# Altium schematic sheet OpenPilot Atom.SchDoc: OpenPilot Atom
size A3; Author: David Ankers; DrawnBy: David Ankers; Engineer: David Ankers; Organization: The OpenPilot Project; DocumentNumber: 1; Revision: A; SheetNumber: 1; SheetTotal: 2; License: Creative Commons BY-NC-SA Non commercial use only; ProjectName: OpenPilot
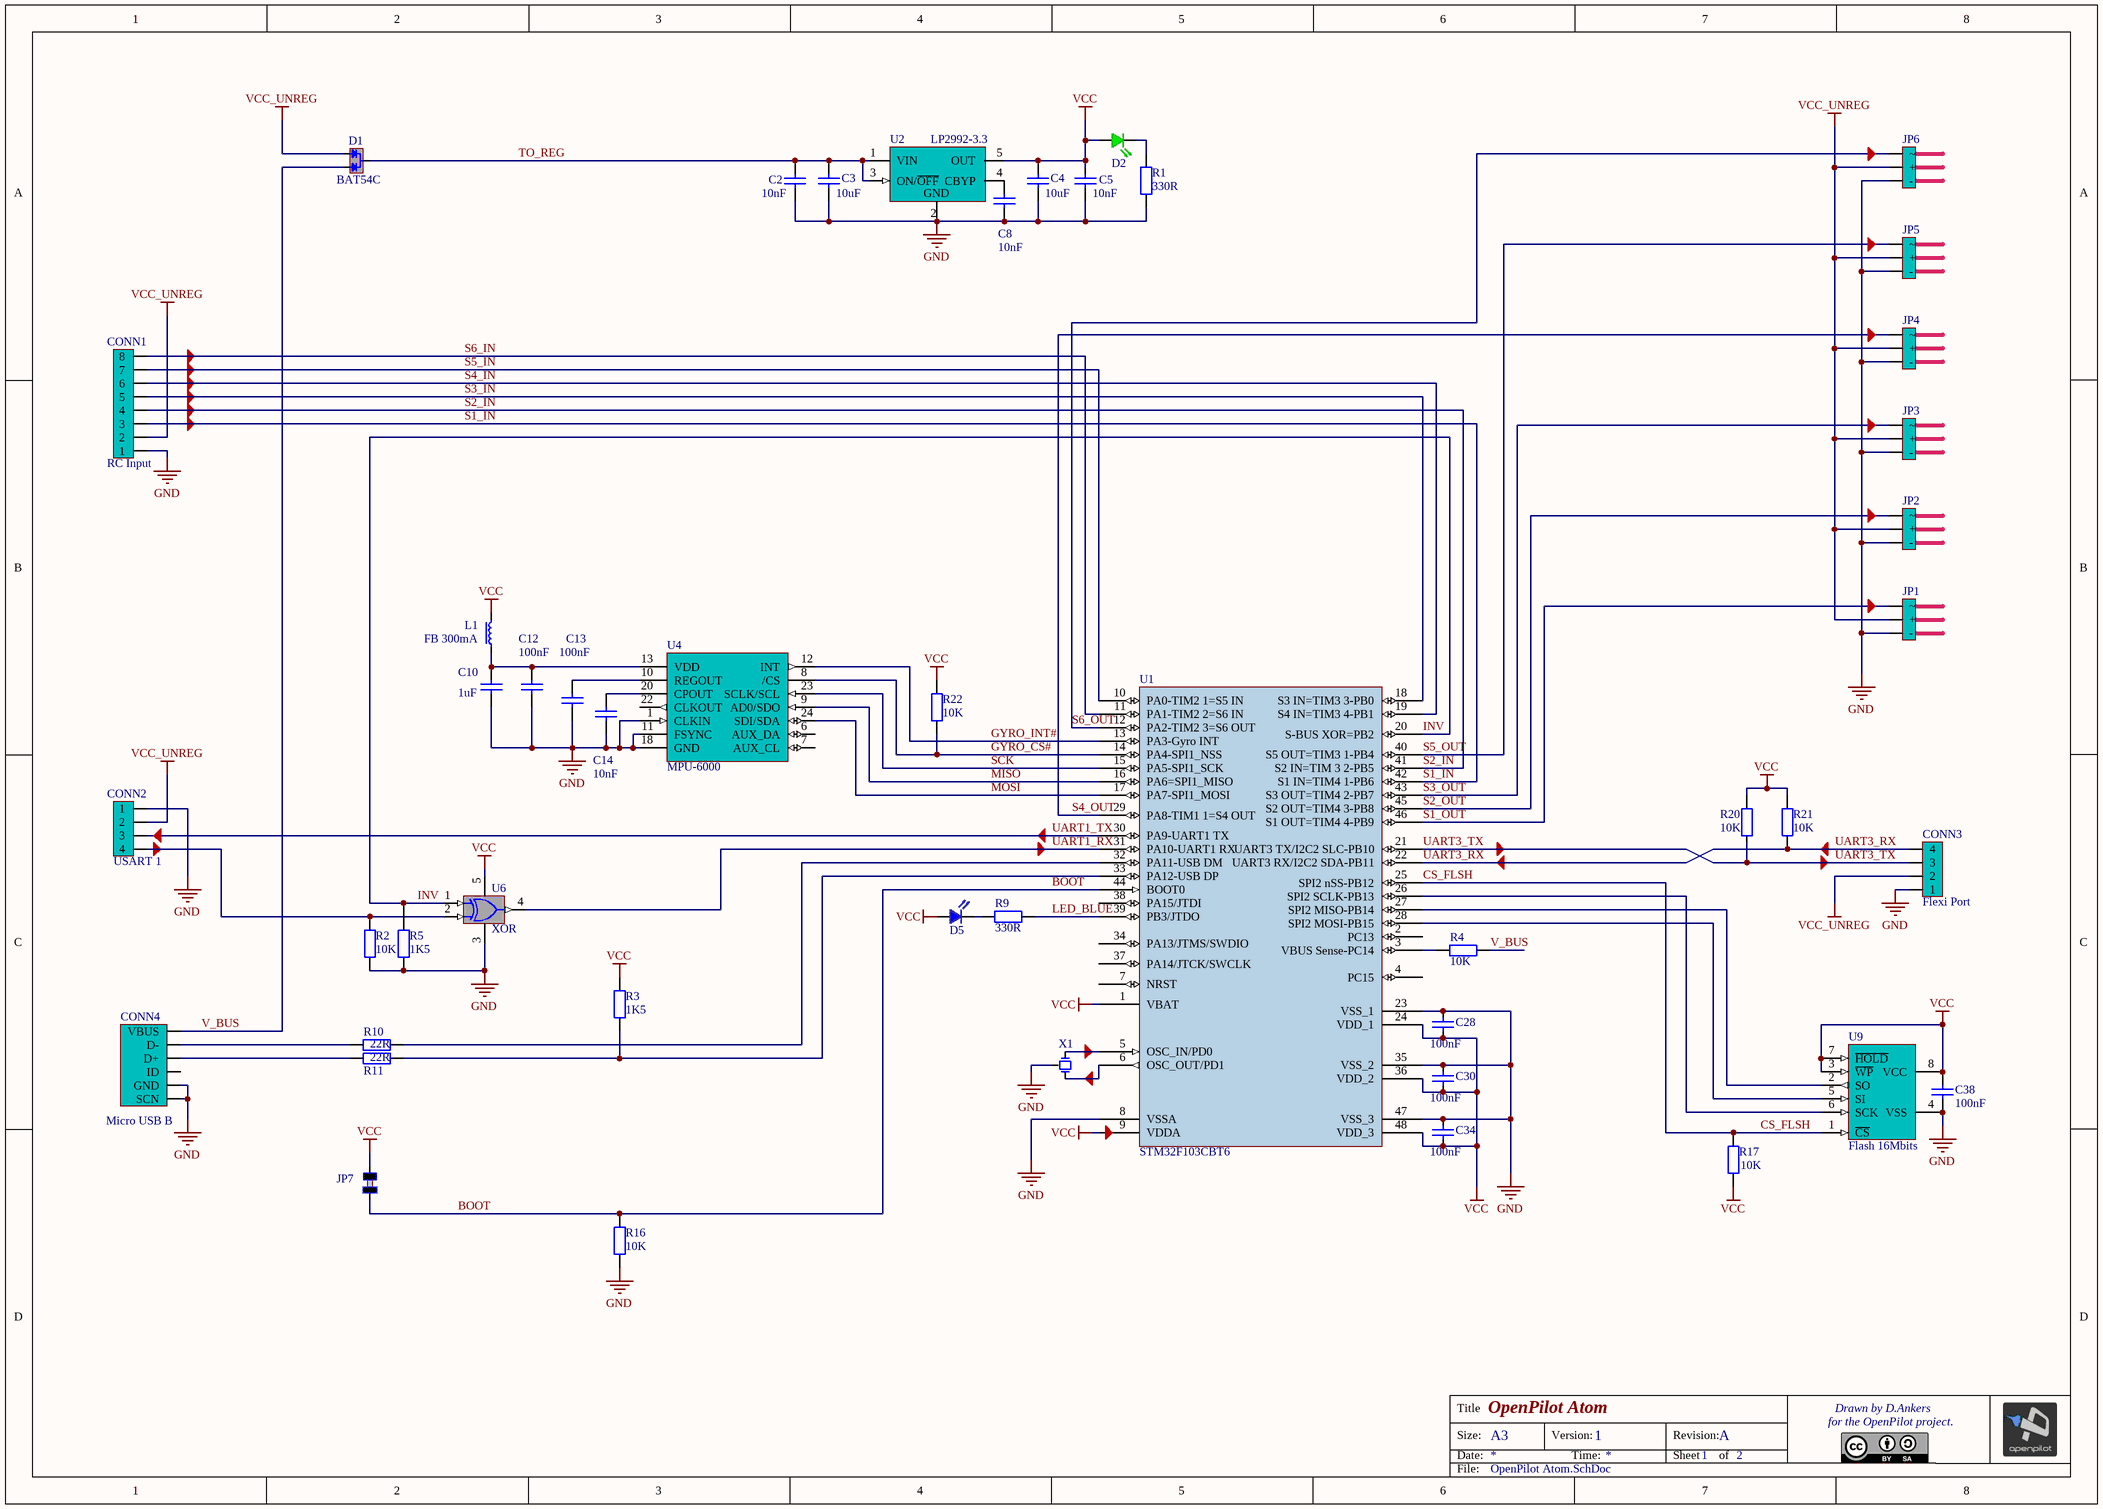
[diagram p0: OpenPilot Atom.SchDoc]

## Parts
C2  value 10nF  [CAP402N]  (hidden comment: 10n)
C3  value 10uF  [CAP805L]  (hidden comment: Cap805)
C4  value 10uF  [CAP805L]  (hidden comment: Cap805)
C5  value 10nF  [CAP402N]  (hidden comment: 10n)
C8  value 10nF  [CAP402N]  (hidden comment: 10n)
C10  1uF  [CAP402N]
C12  value 100nF  [CAP402N]  (hidden comment: Cap402)
C13  value 100nF  [CAP402N]  (hidden comment: Cap402)
C14  value 10nF  [CAP402N]  (hidden comment: 10n)
C28  value 100nF  [CAP402N]  (hidden comment: Cap402)
C30  value 100nF  [CAP402N]  (hidden comment: Cap402)
C34  value 100nF  [CAP402N]  (hidden comment: Cap402)
C38  value 100nF  [CAP402N]  (hidden comment: Cap402)
CONN1  RC Input  [JST SH 8 Pin Side Entry]
CONN2  USART 1  [JST SH 4 Pin Side Entry]
CONN3  Flexi Port  [JST SH 4 Pin Side Entry]
CONN4  Micro USB B  [Micro_USB]
D1  BAT54C  [SOT23-3N]
D2  Green  [LED603N]  (value not drawn)
D5  Blue  [LED603N]  (value not drawn)
JP1  Servo out 1  [SIP3 - 0.1]  (value not drawn)
JP2  Servo out 2  [SIP3 - 0.1]  (value not drawn)
JP3  Servo out 3  [SIP3 - 0.1]  (value not drawn)
JP4  Servo out 4  [SIP3 - 0.1]  (value not drawn)
JP5  Servo out 5  [SIP3 - 0.1]  (value not drawn)
JP6  Servo out 6  [SIP3 - 0.1]  (value not drawn)
JP7  2 PAD Touch JMP  [TOUCH JMP 2PAD]  (value not drawn)
L1  FB 300mA  [IND603N]
R1  value 330R  [RES402N]  (hidden comment: Res402)
R2  value 10K  [RES402N]  (hidden comment: Res402)
R3  value 1K5  [RES402N]  (hidden comment: Res402)
R4  value 10K  [RES402N]  (hidden comment: Res402)
R5  value 1K5  [RES402N]  (hidden comment: Res402)
R9  value 330R  [RES402N]  (hidden comment: Res402)
R10  value 22R  [RES402N]  (hidden comment: Res402)
R11  value 22R  [RES402N]  (hidden comment: Res402)
R16  value 10K  [RES402N]  (hidden comment: Res402)
R17  value 10K  [RES402N]  (hidden comment: Res402)
R20  value 10K  [RES402N]  (hidden comment: Res402)
R21  value 10K  [RES402N]  (hidden comment: Res402)
R22  value 10K  [RES402N]  (hidden comment: Res402)
U1  STM32F103CBT6  [STM32 48 Lead]
U2  LP2992-3.3  [SOT23-5L]
U4  MPU-6000  [IMU-3000]
U6  XOR  [DCK-5]
U9  Flash 16Mbits  [SOIC8_N]
X1  8Mhz Ceralock  [CERALOCK 8Mhz]  (value not drawn)

## Nets
GND: C2.2 C3.2 C4.2 C5.2 C8.2 C10.2 C12.2 C13.2 C14.1 C28.1 C30.1 C34.1 C38.2 CONN1.1 CONN2.1 CONN3.1 CONN4.0(SCN) CONN4.5(GND) JP1.3(-) JP2.3(-) JP3.3(-) JP4.3(-) JP5.3(-) JP6.3(-) R1.1 R2.1 R5.1 R16.1 U1.8(VSSA) U1.23(VSS_1) U1.35(VSS_2) U1.47(VSS_3) U2.2(GND) U4.1(CLKIN) U4.11(FSYNC) U4.18(GND) U6.3(GND) U9.4(VSS) X1.3
VCC: C4.1 C5.1 C28.2 C30.2 C34.2 C38.1 D2.2(A) D5.2(A) JP7.2 L1.2 R3.2 R17.1 R20.2 R21.2 R22.2 U1.1(VBAT) U1.9(VDDA) U1.24(VDD_1) U1.36(VDD_2) U1.48(VDD_3) U2.5(OUT) U6.5(VCC) U9.3(~{WP}) U9.7(~{HOLD}) U9.8(VCC)
VCC_UNREG: CONN1.2 CONN2.2 CONN3.2 D1.1(A1) JP1.2(+) JP2.2(+) JP3.2(+) JP4.2(+) JP5.2(+) JP6.2(+)
BOOT: JP7.1 R16.2 U1.44(BOOT0)
CS_FLSH: R17.2 U1.25(SPI2_nSS-PB12) U9.1(~{CS})
GYRO_CS#: R22.1 U1.14(PA4-SPI1_NSS) U4.8(/CS)
GYRO_INT#: U1.13(PA3-Gyro_INT) U4.12(INT)
INV: R5.2 U1.20(S-BUS_XOR=PB2) U6.1(A)
LED_BLUE: R9.2 U1.39(PB3/JTDO)
MISO: U1.16(PA6=SPI1_MISO) U4.9(AD0/SDO)
MOSI: U1.17(PA7-SPI1_MOSI) U4.24(SDI/SDA)
S1_IN: CONN1.3 U1.42(S1_IN=TIM4_1-PB6)
S1_OUT: JP1.1 U1.46(S1_OUT=TIM4_4-PB9)
S2_IN: CONN1.4 U1.41(S2_IN=TIM_3_2-PB5)
S2_OUT: JP2.1 U1.45(S2_OUT=TIM4_3-PB8)
S3_IN: CONN1.5 U1.18(S3_IN=TIM3_3-PB0)
S3_OUT: JP3.1 U1.43(S3_OUT=TIM4_2-PB7)
S4_IN: CONN1.6 U1.19(S4_IN=TIM3_4-PB1)
S4_OUT: JP4.1 U1.29(PA8-TIM1_1=S4_OUT)
S5_IN: CONN1.7 U1.10(PA0-TIM2_1=S5_IN)
S5_OUT: JP5.1 U1.40(S5_OUT=TIM3_1-PB4)
S6_IN: CONN1.8 U1.11(PA1-TIM2_2=S6_IN)
S6_OUT: JP6.1 U1.12(PA2-TIM2_3=S6_OUT)
SCK: U1.15(PA5-SPI1_SCK) U4.23(SCLK/SCL)
TO_REG: C2.1 C3.1 D1.3(COM) U2.1(VIN) U2.3(ON/~{OFF})
UART1_RX: U1.31(PA10-UART1_RX) U6.4(Y)
UART1_TX: CONN2.3 U1.30(PA9-UART1_TX)
UART3_RX: CONN3.4 R21.1 U1.22(UART3_RX/I2C2_SDA-PB11)
UART3_TX: CONN3.3 R20.1 U1.21(UART3_TX/I2C2_SLC-PB10)
V_BUS: CONN4.1(VBUS) D1.2(A2) R4.1
NetC8_1: C8.1 U2.4(CBYP)
NetC10_1: C10.1 C12.1 L1.1 U4.13(VDD)
NetC13_1: C13.1 U4.10(REGOUT)
NetC14_2: C14.2 U4.20(CPOUT)
NetCONN2_4: CONN2.4 R2.2 U6.2(B)
NetCONN4_2: CONN4.2(D-) R10.2
NetCONN4_3: CONN4.3(D+) R11.2
NetD2_1: D2.1(K) R1.2
NetD5_1: D5.1(K) R9.1
NetR3_1: R3.1 R11.1 U1.33(PA12-USB_DP)
NetR4_2: R4.2 U1.3(VBUS_Sense-PC14)
NetR10_1: R10.1 U1.32(PA11-USB_DM)
NetU1_5: U1.5(OSC_IN/PD0) X1.1
NetU1_6: U1.6(OSC_OUT/PD1) X1.2
NetU1_26: U1.26(SPI2_SCLK-PB13) U9.6(SCK)
NetU1_27: U1.27(SPI2_MISO-PB14) U9.2(SO)
NetU1_28: U1.28(SPI2_MOSI-PB15) U9.5(SI)

Not connected (* = marked no-connect by the designer): CONN4 4(ID); U1 2(PC13) 4(PC15) 7(NRST) 34(PA13/JTMS/SWDIO) 37(PA14/JTCK/SWCLK) 38(PA15/JTDI); U4 2(NC) 3(NC) 4(NC) 5(NC) 6(AUX_DA) 7(AUX_CL) 14(NC) 15(NC) 16(NC) 17(NC) 19(RESV) 21(RESV) 22(CLKOUT)

## Notes on the sheet
- Title
- Size:
- Date:
- A3
- Version:
- Time:
- Revision:
- Sheet
- of
- for the OpenPilot project.
- Drawn by D.Ankers
- File:

## Library data of the parts
C2 C5 C8 C10 C12-C14 C28 C30 C34 C38 = Cap402: Capacitor SMD; Publisher: The OpenPilot Project; Published: 1-Nov-2010; LatestRevisionDate: 1-Nov-2010; LatestRevisionNote: Released OpenPilot Lib; PackageReference: 0402 (1005 Metric); ComponentLink2Description: Datasheet; Supplier 1: Digi-Key
  C2 C5 C8 C14: Supplier Part Number 1: 587-1223-1-ND
  C10: Value: 1uF; Supplier Part Number 1: 445-4978-1-ND
  C12 C13 C28 C30 C34 C38: Supplier Part Number 1: 445-4952-1-ND
C3 C4 = Cap805: Capacitor SMD; Published: 1-Nov-2010; LatestRevisionDate: 1-Nov-2010; LatestRevisionNote: Released OpenPilot Lib; PackageReference: 0805 (2012 Metric); Publisher: The OpenPilot Project; Supplier 1: Digi-Key; Supplier Part Number 1: 490-3886-1-ND
CONN1 = JST-SH 8-pin Side Entry Socket: Manufacturer: Generic Components; Class: Connector; Supplier 1: Digi-Key; Supplier Part Number 1: 455-1808-1-ND
CONN2 CONN3 = JST-SH 4-pin Side Entry Socket: Manufacturer: Generic Components; Class: Connector; Supplier 1: Digi-Key; Supplier Part Number 1: 455-1804-1-ND
CONN4 = USB Micro B SMT: USB Micro B SMT Socket; Class: Connector; ComponentLink2Description: Datasheet; LatestRevisionDate: 1-Nov-2010; LatestRevisionNote: Released OpenPilot Lib; Published: 1-Nov-2010; Publisher: The OpenPilot Project; Supplier 1: Digi-Key; Supplier Part Number 1: WM17141CT-ND
D1 = BAT54C: Dual Diode Command Cathode; Supplier 1: Digi-Key; Supplier Part Number 1: 497-3786-1-ND
D2 = LED 603 Gr: Green 603 LED; Value: 2.1v 20mA; Supplier 1: Digi-Key; Supplier Part Number 1: 754-1116-1-ND
D5 = LED 603 Bl: Blue 603 LED; Supplier 1: Digi-Key; Supplier Part Number 1: 350-2037-1-ND
JP1-JP6 = Hdr 3 Pin 0.1: Header, 3-Pin, 0.1"; Manufacturer: Generic Components; Class: Connector; Supplier 1: Digi-Key; Supplier Part Number 1: MTLW-103-23-S-S-260-ND
JP7 = 2 PAD Touch JMP: 2 Pad Touch Jumper; LatestRevisionDate: 1-Nov-2010; LatestRevisionNote: Released OpenPilot Lib; Published: 1-Nov-2010; Publisher: The OpenPilot Project
L1 = FerriteBead_300mA: Ferrite Bead 300mA; Manufacturer: Generic Components; Class: Passive; Supplier 1: Digi-Key; Supplier Part Number 1: 732-1586-1-ND
R1-R5 R9-R11 R16 R17 R20-R22 = Res402: Resistor SMD; Published: 1-Nov-2010; LatestRevisionDate: 1-Nov-2010; LatestRevisionNote: Released OpenPilot Lib; PackageReference: 0402 ( 1005 Metric); Publisher: The OpenPilot Project; ComponentLink2Description: Datasheet; Supplier 1: Digi-Key
  R1 R9: Supplier Part Number 1: P330LCT-ND
  R2 R4 R16 R17 R20-R22: Supplier Part Number 1: P10.0KLCT-ND
  R3 R5: Supplier Part Number 1: P1.50KLCT-ND
  R10 R11: Supplier Part Number 1: P22.0LCT-ND
U1 = STM32F103CBT6: STM32 ARM-based 32-bit MCU with 128 Kbytes Flash, 48-pin LQFP, Industrial Temperature; Published: 30-May-2008; DatasheetVersion: rev6, Mar-2008; PackageVersion: Mar-2008; PackageReference: LQFP48; Publisher: Altium Limited; PackageDescription: 48-Pin Low-Profile Quad Flat Pack, 7 x 7 mm Body, 0.5 mm Pitch (LQFP48); ComponentLink1Description: Manufacturer Link; ComponentLink1URL: www.st.com/stm32; ComponentLink2Description: Datasheet; ComponentLink2URL: http://www.st.com/stonline/products/literature/ds/13587.pdf; Supplier 1: Digi-Key; Supplier Part Number 1: 497-6288-ND
U2 = LP2985-3.3: 3.3V 250mA LDO Regulator; Supplier 1: Digi-Key; Supplier Part Number 1: LP2992AIM5-3.3/NOPBCT-ND
U4 = MPU-3/6000: Invensense MPU-3/6000,  3-axis Gyros & Accel on 6000; ComponentLink2Description: Datasheet; LatestRevisionDate: 1-Nov-2010; LatestRevisionNote: Released OpenPilot Lib; Published: 1-Nov-2010; Publisher: The OpenPilot Project; Manufacturer: Invensense; Supplier 1: Invensense; Supplier Part Number 1: MPU-6000
U6 = XOR SN74LVC1G86DCKR: XOR Gate SN74LVC1G86DCKR; Supplier 1: Digi-Key; Supplier Part Number 1: 296-9854-1-ND
U9 = Flash 16Mb 75MHZ 8SOIC: 16Mbit SPI Flash Memory; ComponentLink2Description: Datasheet; LatestRevisionDate: 1-Nov-2010; LatestRevisionNote: Released OpenPilot Lib; Published: 1-Nov-2010; Publisher: The OpenPilot Project; Supplier 1: Digi-Key; Supplier Part Number 1: M25P16-VMN6P-ND
X1 = CERALOCK8: Ceralock 8Mhz with caps; Class: Oscillator; SubClass: Ceramic Oscillator; ComponentLink2Description: Datasheet; LatestRevisionDate: 1-Nov-2010; LatestRevisionNote: Released OpenPilot Lib; Published: 1-Nov-2010; Publisher: The OpenPilot Project; Supplier 1: Digi-Key; Supplier Part Number 1: 490-1195-1-ND